# EAGLE schematic PowerBike (EAGLE 6.3)
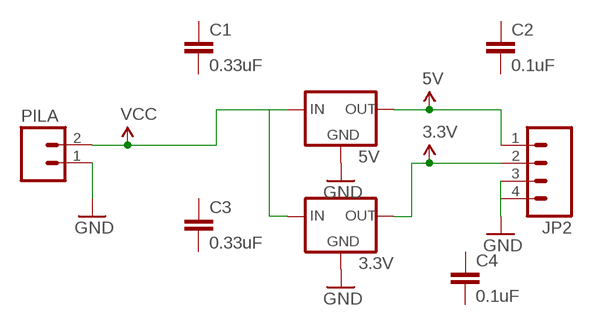
[diagram p0: schematic, sheet 1]

## Parts
3.3V  V_REG_78XXSIDE  [78XXL]
5V  V_REG_78XXSIDE  [78XXL]
C1  0.33uF  CAP0603-CAP  [0603-CAP]
C2  0.1uF  CAP0603-CAP  [0603-CAP]
C3  0.33uF  CAP0603-CAP  [0603-CAP]
C4  0.1uF  CAP0603-CAP  [0603-CAP]
JP2  M04LOCK_LONGPADS  [1X04_LOCK_LONGPADS]
PILA  M02LOCK_LONGPADS  [1X02_LOCK_LONGPADS]

## Nets
3.3V: 3.3V.OUT JP2.2
5V: 5V.OUT JP2.1
GND: 3.3V.GND 5V.GND JP2.3 JP2.4 PILA.1
VCC: 3.3V.IN 5V.IN PILA.2
Unconnected: C1.1 C1.2 C2.1 C2.2 C3.1 C3.2 C4.1 C4.2

## Library data of the parts
3.3V 5V = SparkFun-PowerIC:V_REG_78XX: Voltage Regulator Standard 7805 5V regulator. IGO (Input Ground Output). Spark Fun Electronics SKU : COM-00107
C1-C4 = SparkFun-Passives:CAP: Capacitor Standard 0603 ceramic capacitor, and 0.1" leaded capacitor.
JP2 = SparkFun-Connectors:M04: Header 4 Standard 4-pin 0.1" header. Use with straight break away headers (SKU : PRT-00116), right angle break away headers (PRT-00553), swiss pins (PRT-00743), machine pins (PRT-00117), and female headers (PRT-00115). Molex polarized connector foot print use with SKU : PRT-08231 with associated crimp pins and housings. 1MM SMD Version SKU: PRT-10208
PILA = SparkFun-Connectors:M02: Header 2 Standard 2-pin 0.1" header. Use with straight break away headers (SKU : PRT-00116), right angle break away headers (PRT-00553), swiss pins (PRT-00743), machine pins (PRT-00117), and female headers (PRT-00115). Molex polarized connector foot print use with SKU : PRT-08233 with associated crimp pins and housings.